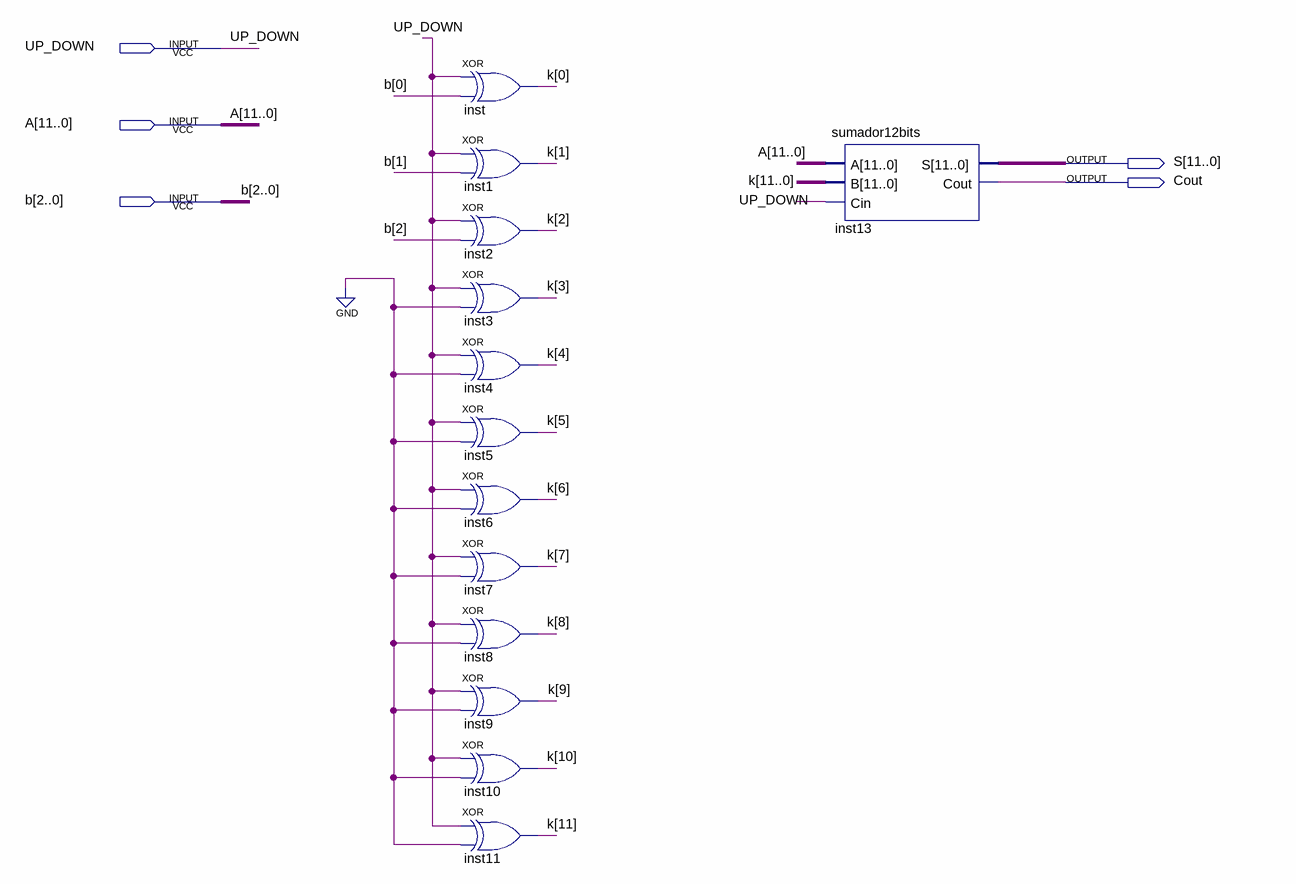
[diagram p0: schematic sheet]
// Quartus schematic sumador_restador.bdf as structural Verilog: 13 symbols, 5 pins
module sumador_restador (
  input  UP_DOWN,
  input  [11:0] A,
  input  [2:0] b,
  output [11:0] S,
  output Cout
);

  wire [11:0] k;

  xor inst (k[0], UP_DOWN, b[0]);
  xor inst1 (k[1], UP_DOWN, b[1]);
  xor inst2 (k[2], UP_DOWN, b[2]);
  xor inst3 (k[3], UP_DOWN, 1'b0);
  xor inst4 (k[4], UP_DOWN, 1'b0);
  xor inst5 (k[5], UP_DOWN, 1'b0);
  xor inst6 (k[6], UP_DOWN, 1'b0);
  xor inst7 (k[7], UP_DOWN, 1'b0);
  xor inst8 (k[8], UP_DOWN, 1'b0);
  xor inst9 (k[9], UP_DOWN, 1'b0);
  xor inst10 (k[10], UP_DOWN, 1'b0);
  xor inst11 (k[11], UP_DOWN, 1'b0);
  sumador12bits inst13 (.A(A), .B(k), .Cin(UP_DOWN), .S(S), .Cout(Cout));
endmodule
